# EAGLE design rbg-snowman-2011-r1 (EAGLE 5.11)
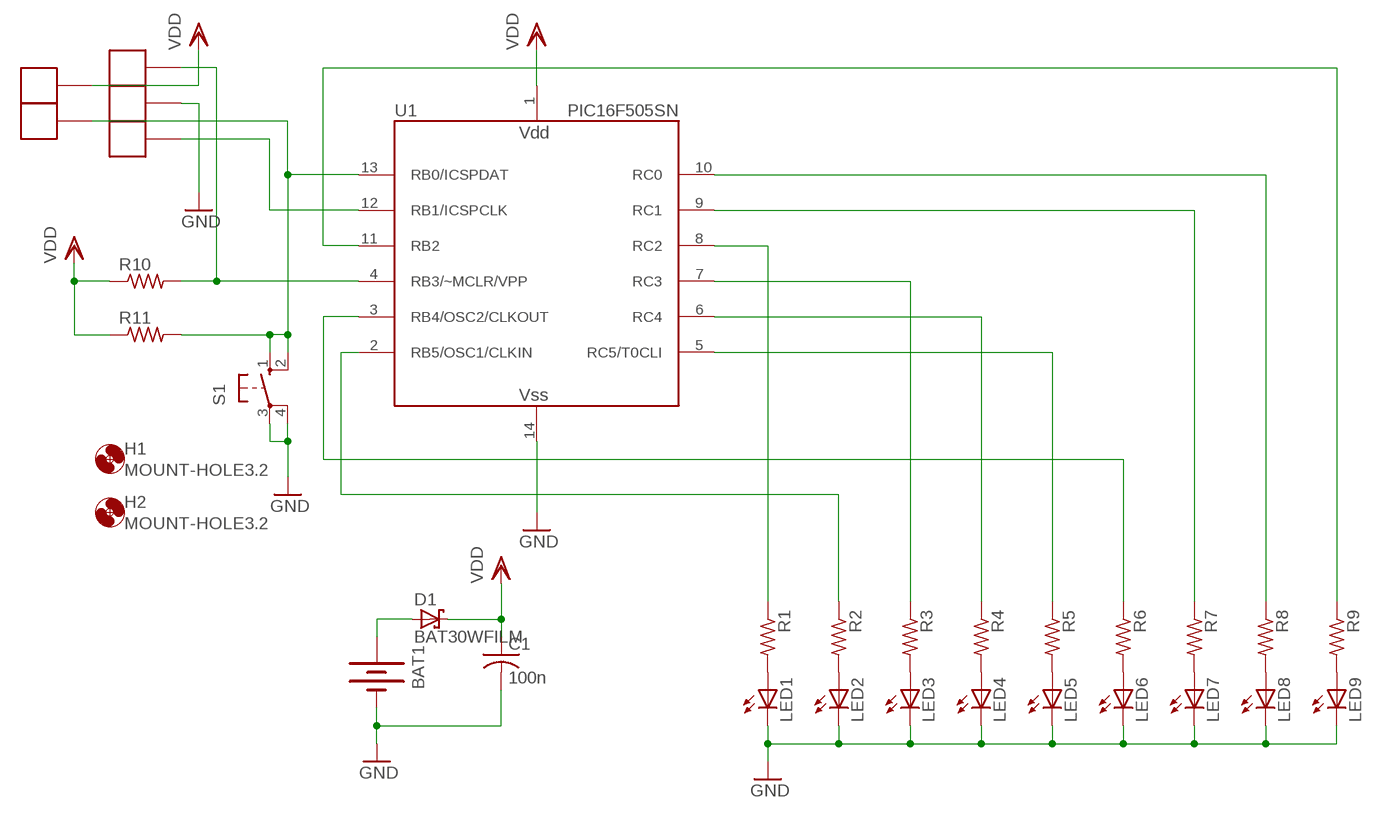
[diagram p0: schematic, sheet 1]

## Parts
BAT1  BATTERY20SMD  [BATTCON_20MM]
C1  100n  C-USC0603  [C0603]
D1  BAT30WFILM  [SOT323-R]
H1  MOUNT-HOLE3.2  [3,2]
H2  MOUNT-HOLE3.2  [3,2]
LED1  LEDCHIPLED_0603  [CHIPLED_0603]
LED2  LEDCHIPLED_0603  [CHIPLED_0603]
LED3  LEDCHIPLED_0603  [CHIPLED_0603]
LED4  LEDCHIPLED_0603  [CHIPLED_0603]
LED5  LEDCHIPLED_0603  [CHIPLED_0603]
LED6  LEDCHIPLED_0603  [CHIPLED_0603]
LED7  LEDCHIPLED_0603  [CHIPLED_0603]
LED8  LEDCHIPLED_0603  [CHIPLED_0603]
LED9  LEDCHIPLED_0603  [CHIPLED_0603]
R1  R-US_R0603  [R0603]
R2  R-US_R0603  [R0603]
R3  R-US_R0603  [R0603]
R4  R-US_R0603  [R0603]
R5  R-US_R0603  [R0603]
R6  R-US_R0603  [R0603]
R7  R-US_R0603  [R0603]
R8  R-US_R0603  [R0603]
R9  R-US_R0603  [R0603]
R10  R-US_R0603  [R0603]
R11  R-US_R0603  [R0603]
S1  10-XX  [B3F-10XX]
U1  PIC16F505SN  [SOIC-14]
X1  PAD-1.5X3  [PAD-1.5X3]
X2  PAD-1.5X3  [PAD-1.5X3]
X3  PAD-1.5X3  [PAD-1.5X3]
X4  PAD-1.5X3  [PAD-1.5X3]
X5  PAD-1.5X3  [PAD-1.5X3]

## Nets
GND: BAT1.2(-) C1.2 LED1.C LED2.C LED3.C LED4.C LED5.C LED6.C LED7.C LED8.C LED9.C S1.3(P) S1.4(P1) U1.14(VSS) X3.P$1
MCLR: R10.2 U1.4(RB3/~MCLR/VPP) X1.P$1
N$1: LED8.A R8.2
N$2: LED7.A R7.2
N$3: LED6.A R6.2
N$4: LED5.A R5.2
N$5: LED4.A R4.2
N$6: LED3.A R3.2
N$7: LED2.A R2.2
N$8: LED1.A R1.2
N$9: LED9.A R9.2
N$10: R9.1 U1.11(RB2)
N$11: R8.1 U1.10(RC0)
N$12: R7.1 U1.9(RC1)
N$13: R1.1 U1.8(RC2)
N$14: R3.1 U1.7(RC3)
N$15: R4.1 U1.6(RC4)
N$16: R5.1 U1.5(RC5/T0CLI)
N$17: R6.1 U1.3(RB4/OSC2/CLKOUT)
N$18: R2.1 U1.2(RB5/OSC1/CLKIN)
N$22: BAT1.1(+) D1.1(A)
PGC: U1.12(RB1/ICSPCLK) X5.P$1
PGD: R11.2 S1.1(S) S1.2(S1) U1.13(RB0/ICSPDAT) X4.P$1
VDD: C1.1 D1.3(C) R10.1 R11.1 U1.1(VDD) X2.P$1

## Library data of the parts
BAT1 = sfe-sparkfun:BATTERY: Battery Holders Various common sizes : AA, AAA, 20mm coin cell and 12mm coin cell.
C1 = rcl:C-US: CAPACITOR, American symbol
D1 = rbg-st-schottky-diode:BAT30: Silicon Schottky Diodes General-purpose diode for high-speed switching
H1 H2 = holes:MOUNT-HOLE: MOUNTING HOLE with drill center marker
LED1-LED9 = led:LED: LED OSRAM: - CHIPLED LG R971, LG N971, LY N971, LG Q971, LY Q971, LO R971, LY R971 LH N974, LH R974 LS Q976, LO Q976, LY Q976 LO Q996 - Hyper CHIPLED LW Q18S LB Q993, LB Q99A, LB R99A - SideLED LS A670, LO A670, LY A670, LG A670, LP A670 LB A673, LV A673, LT A673, LW A673 LH A674 LY A675 LS A676, LA A676, LO A676, LY A676, LW A676 LS A679, LY A679, LG A679 - Hyper Micro SIDELED® LS Y876, LA Y876, LO Y876, LY Y876 LT Y87S - SmartLED LW L88C, LW L88S LB L89C, LB L89S, LG L890 LS L89K, LO L89K, LY L89K LS L896, LA L896, LO L896, LY L896 - TOPLED LS T670, LO T670, LY T670, LG T670, LP T670 LSG T670, LSP T670, LSY T670, LOP T670, LYG T670 LG T671, LOG T671, LSG T671 LB T673, LV T673, LT T673, LW T673 LH T674 LS T676, LA T676, LO T676, LY T676, LB T676, LH T676, LSB T676, LW T676 LB T67C, LV T67C, LT T67C, LS T67K, LO T67K, LY T67K, LW E67C LS E67B, LA E67B, LO E67B, LY E67B, LB E67C, LV E67C, LT E67C LW T67C LS T679, LY T679, LG T679 LS T770, LO T770, LY T770, LG T770, LP T770 LB T773, LV T773, LT T773, LW T773 LH T774 LS E675, LA E675, LY E675, LS T675 LS T776, LA T776, LO T776, LY T776, LB T776 LHGB T686 LT T68C, LB T68C - Hyper Mini TOPLED® LB M676 - Mini TOPLED Santana® LG M470 LS M47K, LO M47K, LY M47K Source: http://www.osram.convergy.de LUXEON: - LUMILED® LXK2-PW12-R00, LXK2-PW12-S00, LXK2-PW14-U00, LXK2-PW14-V00 LXK2-PM12-R00, LXK2-PM12-S00, LXK2-PM14-U00 LXK2-PE12-Q00, LXK2-PE12-R00, LXK2-PE12-S00, LXK2-PE14-T00, LXK2-PE14-U00 LXK2-PB12-K00, LXK2-PB12-L00, LXK2-PB12-M00, LXK2-PB14-N00, LXK2-PB14-P00, LXK2-PB14-Q00 LXK2-PR12-L00, LXK2-PR12-M00, LXK2-PR14-Q00, LXK2-PR14-R00 LXK2-PD12-Q00, LXK2-PD12-R00, LXK2-PD12-S00 LXK2-PH12-R00, LXK2-PH12-S00 LXK2-PL12-P00, LXK2-PL12-Q00, LXK2-PL12-R00 Source: www.luxeon.com KINGBRIGHT: KA-3528ASYC Source: www.kingbright.com
R1-R11 = rcl:R-US_: RESISTOR, American symbol
S1 = rbg-generic-tact-switch:10-XX: OMRON SWITCH
U1 = microchip:PIC16F505: Microchip PIC16F505 14-pin 8-bit Flash microcontroller 1024 words program memory, 72 bytes RAM 12 I/O, 1 8-bit timer
X1-X5 = rbg-generic-pads:PAD

## Board
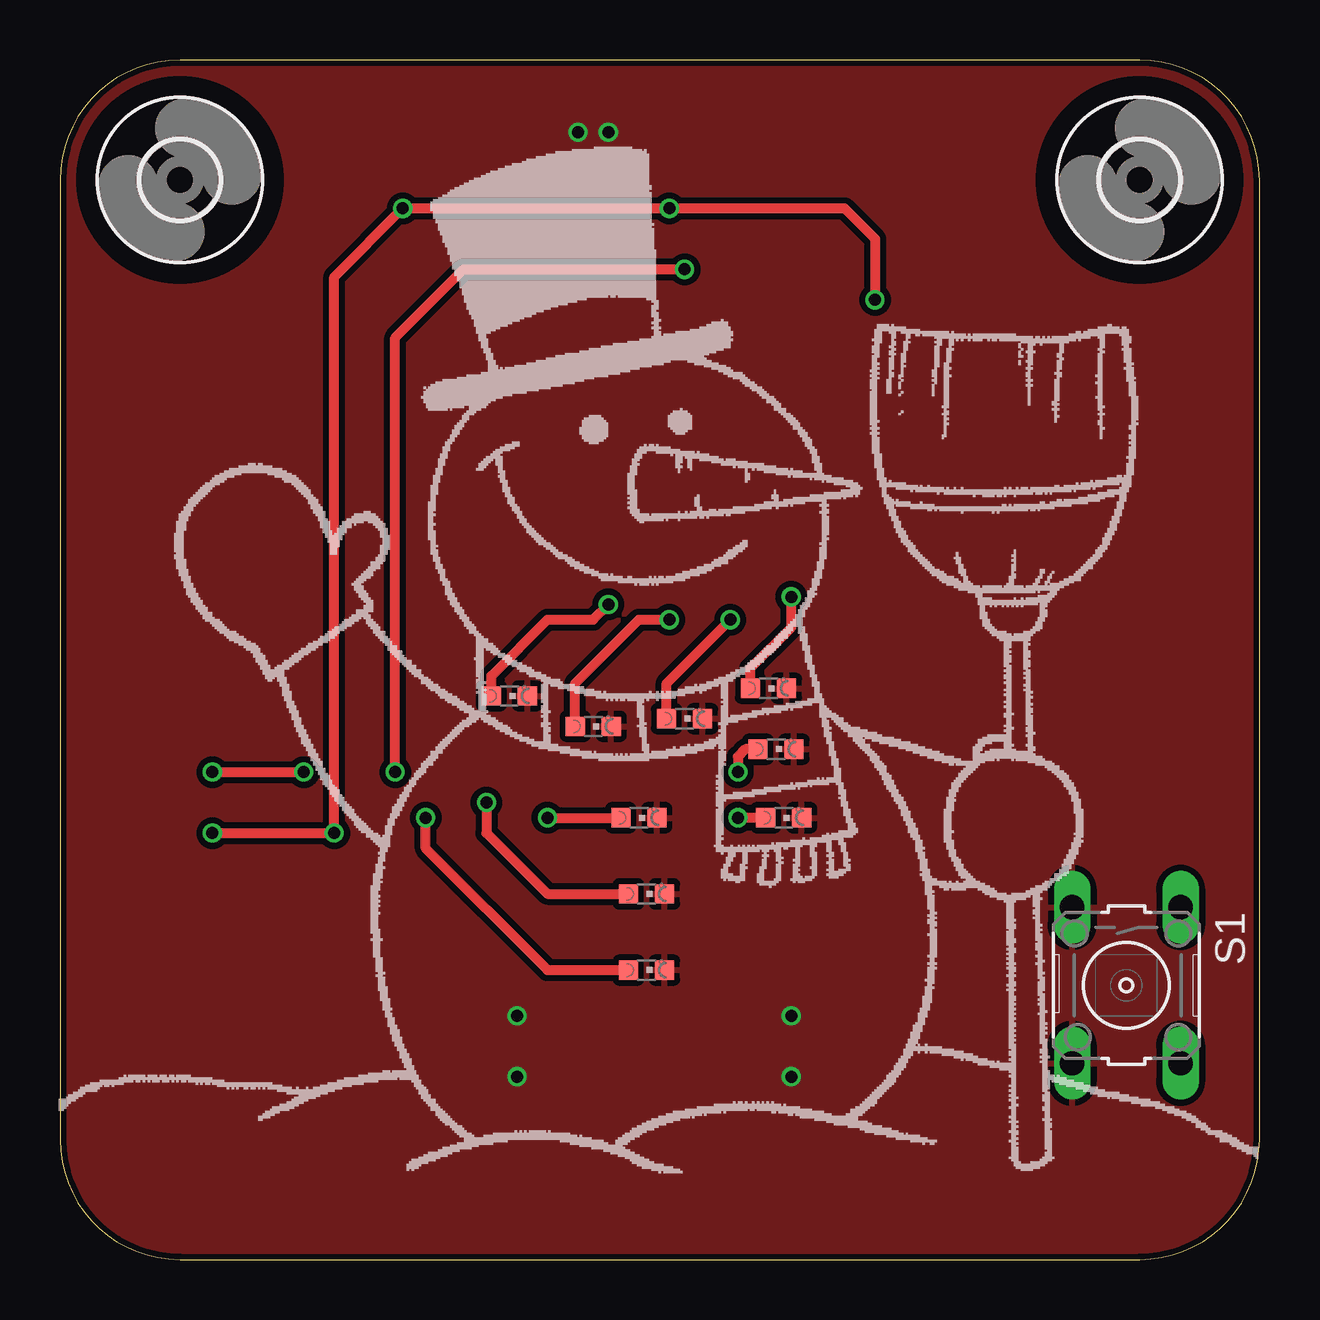
[diagram p1: board, top side]
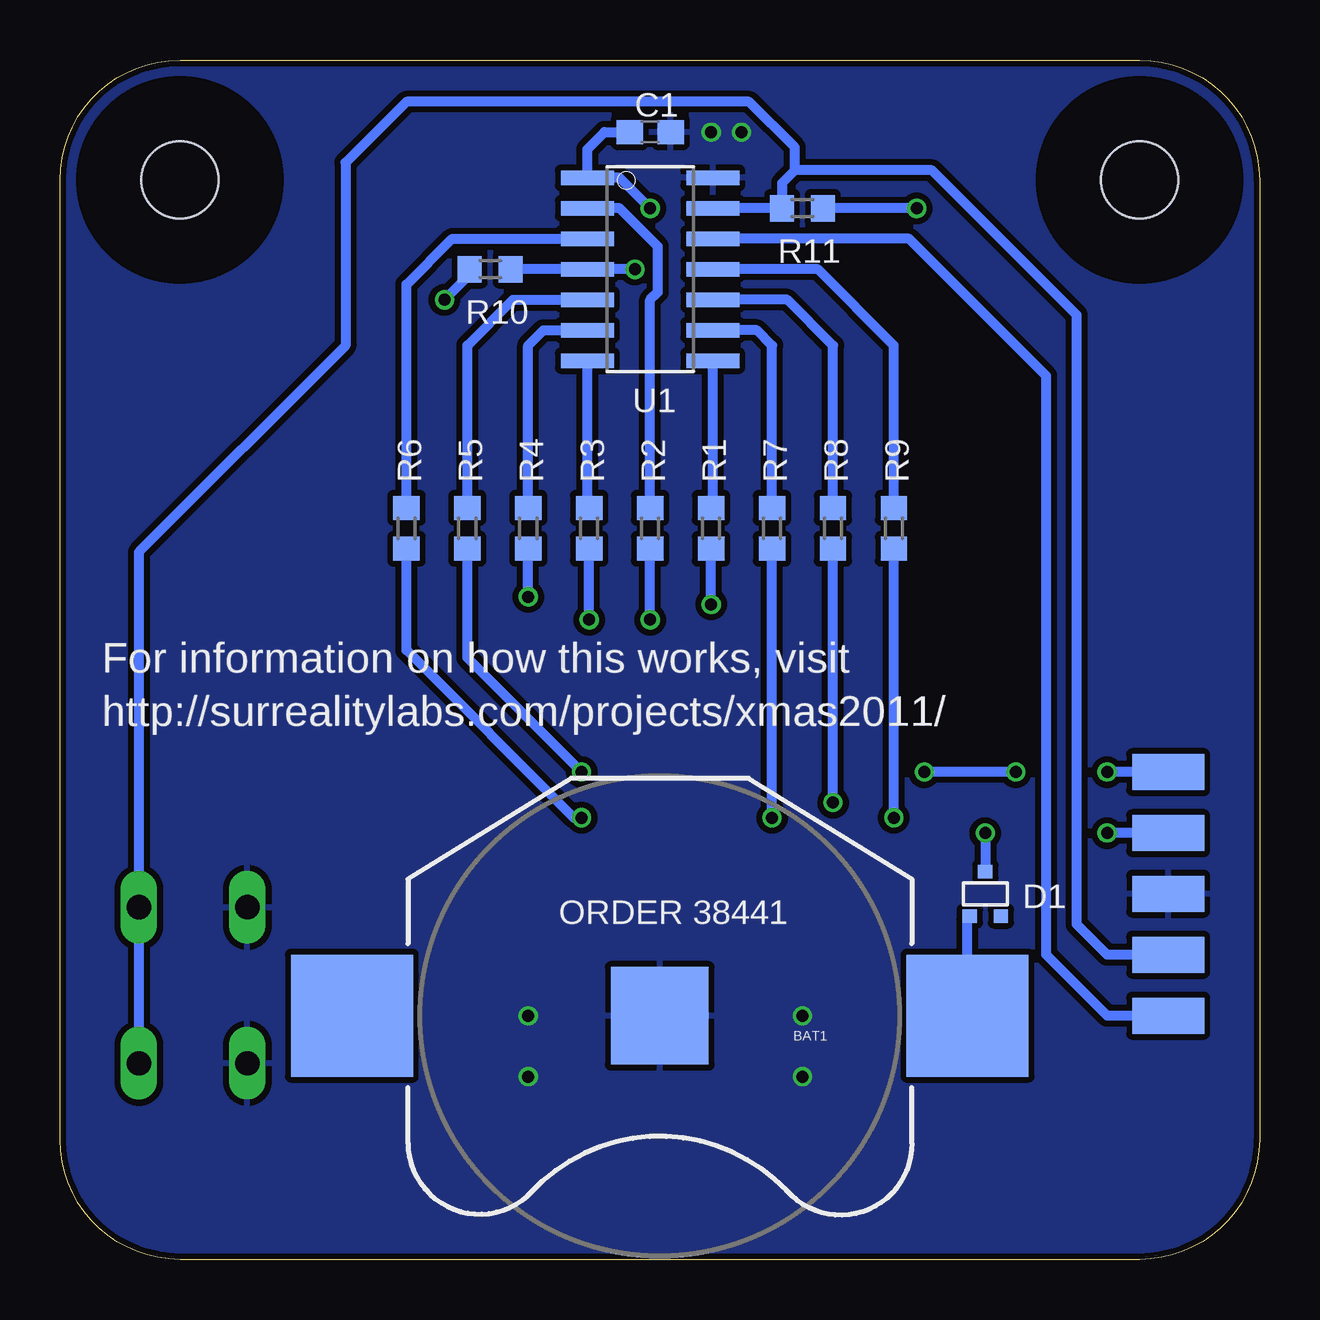
[diagram p2: board, bottom side, seen from below]

Size 50 x 50 mm. Coordinates in mm from the lower left corner, seen from the top.
Outline: 5,50 arc90 0,45 0,5 arc90 5,0 45,0 arc90 50,5 50,45 arc90 45,50 5,50
Copper layers (1*16): Top 0.035mm / dielectric 1.5mm / Bottom 0.035mm
Design rules "Fusion_eagle_rule_v1.1": minimum track width 6mil, minimum drill 12mil, track to track 6mil, track to pad 6mil, pad to pad 6mil, via to via 6mil, smd to smd 0mil, copper to edge 10mil, drill to drill 10mil, minimum pad ring 10mil, minimum via ring 6mil, stop-mask expansion 2mil, vias tented up to drill 100mil, thermal gap 10mil

### Footprints (pad centres in the part's own frame; a part is rotated, then mirrored left to right if it is on the bottom)
BATTCON_20MM = smd 5.08 x 5.08: 1 -12.827,0; 3 12.827,0 | smd 4.064 x 4.064: 2 0,0
C0603 = smd 1.1 x 1: 1 -0.85,0; 2 0.85,0
SOT323-R = smd 0.6 x 0.55: 1 -0.65,-0.925; 2 0.65,-0.925; 3 0,0.925
3,2 = hole 3.2: 0,0
CHIPLED_0603 = smd 0.8 x 0.8: A 0,-0.75; C 0,0.75
R0603 = smd 1 x 1.1: 1 -0.85,0; 2 0.85,0
B3F-10XX = drill 1.016 long: 1 -3.251,2.261; 2 3.251,2.261; 3 -3.251,-2.261; 4 3.251,-2.261
SOIC-14 = smd 2.21 x 0.61: 1 -2.616,4.445; 2 -2.616,3.175; 3 -2.616,1.905; 4 -2.616,0.635; 5 -2.616,-0.635; 6 -2.616,-1.905; 7 -2.616,-3.175; 8 2.616,-3.175; 9 2.616,-1.905; 10 2.616,-0.635; 11 2.616,0.635; 12 2.616,1.905; 13 2.616,3.175; 14 2.616,4.445
PAD-1.5X3 = smd 3 x 1.5: P$1 0,0

### Placement (x,y rotation side)
BAT1  25,10.16 180 bottom
C1  25.4,46.99 0 bottom
D1  11.43,15.24 0 bottom
H1  5,45 0 top
H2  45,45 0 top
LED1  18.73,23.5 270 top
LED2  22.23,22.23 270 top
LED3  26.04,22.54 270 top
LED4  29.53,23.81 270 top
LED5  29.84,21.27 270 top
LED6  30.16,18.41 270 top
LED7  24.13,18.41 270 top
LED8  24.45,15.24 270 top
LED9  24.45,12.06 270 top
R1  22.86,30.48 270 bottom
R2  25.4,30.48 270 bottom
R3  27.94,30.48 270 bottom
R4  30.48,30.48 270 bottom
R5  33.02,30.48 270 bottom
R6  35.56,30.48 270 bottom
R7  20.32,30.48 270 bottom
R8  17.78,30.48 270 bottom
R9  15.24,30.48 270 bottom
R10  32.07,41.27 0 bottom
R11  19.05,43.81 180 bottom
S1  44.45,11.43 270 top
U1  25.4,40.64 0 bottom
U$1  [SNOWMAN2]  0,2.54 0 top
X1  3.81,20.32 0 bottom
X2  3.81,17.78 0 bottom
X3  3.81,15.24 0 bottom
X4  3.81,12.7 0 bottom
X5  3.81,10.16 0 bottom

### Tracks (layer width: path | path; a pad name or v marks a point on that pad's centre or on a via)
GND  (via drill 0.5)
  other vias: 19.05,10.16 19.05,7.62 30.48,10.16 30.48,7.62 22.86,46.99 21.59,46.99
  pour Top (isolate 0.254): -1.27,50.8 50.8,50.8 50.8,-1.27 -1.27,-1.27
  pour Bottom (isolate 0.254): -1.27,50.8 50.8,50.8 50.8,-1.27 -1.27,-1.27
MCLR  (via drill 0.5)
  Top 0.406: v26.04,41.27 16.83,41.27 13.97,38.42 v13.97,20.32 | v6.35,20.32 v10.16,20.32
  Bottom 0.406: R10.2 U1.4 v26.04,41.27 | v10.16,20.32 v13.97,20.32 | X1.P$1 v6.35,20.32
N$1  (via drill 0.5)
  Top 0.406: v17.78,19.05 17.78,17.78 20.32,15.24 LED8.A
  Bottom 0.406: v17.78,19.05 R8.2
N$2  (via drill 0.5)
  Top 0.406: v20.32,18.41 LED7.A
  Bottom 0.406: v20.32,18.41 R7.2
N$3  (via drill 0.5)
  Top 0.406: LED6.A v28.26,18.41
  Bottom 0.406: v28.26,18.41 28.57,18.41 35.56,25.4 R6.2
N$4  (via drill 0.5)
  Top 0.406: LED5.A 28.57,21.27 28.26,20.95 v28.26,20.32
  Bottom 0.406: v28.26,20.32 33.02,25.08 R5.2
N$5  (via drill 0.5)
  Top 0.406: LED4.A 28.78,24.65 30.48,26.35 v30.48,27.62
  Bottom 0.406: v30.48,27.62 R4.2
N$6  (via drill 0.5)
  Top 0.406: LED3.A 25.29,24.02 v27.94,26.67
  Bottom 0.406: v27.94,26.67 R3.2
N$7  (via drill 0.5)
  Top 0.406: LED2.A 21.48,24.02 24.13,26.67 v25.4,26.67
  Bottom 0.406: v25.4,26.67 R2.2
N$8  (via drill 0.5)
  Top 0.406: LED1.A 17.98,24.33 20.32,26.67 22.23,26.67 v22.86,27.3
  Bottom 0.406: v22.86,27.3 R1.2
N$9  (via drill 0.5)
  Top 0.406: v15.24,18.41 15.24,17.14 20.32,12.06 LED9.A
  Bottom 0.406: v15.24,18.41 R9.2
N$10
  Bottom 0.406: U1.11 18.41,41.27 15.24,38.1 R9.1
N$11
  Bottom 0.406: U1.10 19.68,40.01 17.78,38.1 R8.1
N$12
  Bottom 0.406: U1.9 20.95,38.73 20.32,38.1 R7.1
N$13
  Bottom 0.406: U1.8 22.78,31.41 R1.1
N$14
  Bottom 0.406: U1.7 28.02,31.41 R3.1
N$15
  Bottom 0.406: U1.6 29.84,38.73 30.48,38.1 R4.1
N$16
  Bottom 0.406: U1.5 31.11,40.01 33.02,38.1 R5.1
N$17
  Bottom 0.406: U1.3 33.66,42.55 35.56,40.64 R6.1
N$18
  Bottom 0.406: U1.2 26.67,43.81 25.08,42.23 25.08,40.32 25.4,40.01 R2.1
N$22
  Bottom 0.406: BAT1.1 12.17,14.22 D1.1
PGC
  Bottom 0.406: U1.12 14.61,42.55 8.89,36.83 8.89,12.7 6.35,10.16 X5.P$1
PGD
  Bottom 0.406: U1.13 R11.2 19.9,44.87 19.37,45.4 | 19.37,45.4 13.65,45.4 7.62,39.37 7.62,13.97 6.35,12.7 X4.P$1 | S1.2 S1.1 46.71,29.49 38.1,38.1 38.1,45.72 35.56,48.26 21.27,48.26 19.37,46.35 19.37,45.4
VDD  (via drill 0.5)
  Top 0.406: v33.97,40.01 33.97,42.55 32.7,43.81 v25.4,43.81 v14.29,43.81 11.43,40.96 v11.43,17.78 v6.35,17.78
  Bottom 0.406: C1.1 27.3,46.99 28.02,46.28 U1.1 26.67,45.09 v25.4,43.81 | v14.29,43.81 R11.1 | R10.1 32.92,41.06 v33.97,40.01 | v11.43,17.78 D1.3 | X2.P$1 v6.35,17.78

### Text on the board
bPlace: ORDER 38441
bNames: For information on how this works, visit | http://surrealitylabs.com/projects/xmas2011/